# EAGLE design MCU-schematic (EAGLE 9.6.2)
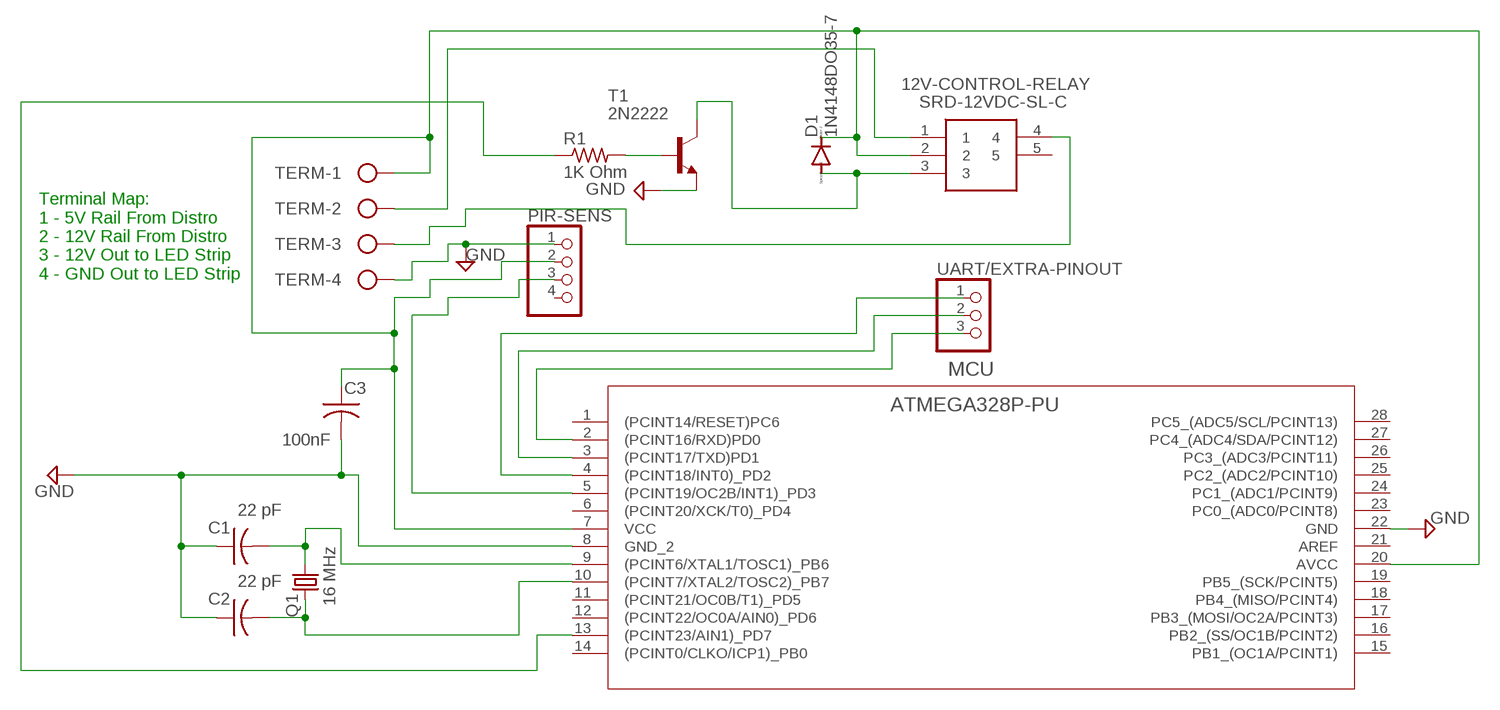
[diagram p0: schematic, sheet 1]

## Parts
12V-CONTROL-RELAY  SRD-12VDC-SL-C  [SRD]
C1  22 pF  C-USC0805  [C0805]
C2  22 pF  C-USC0805  [C0805]
C3  100nF  C-USC0805  [C0805]
D1  1N4148DO35-7  [DO35-7]
MCU  ATMEGA328P-PU  [28P3_ATM]
PIR-SENS  PINHD-1X4  [1X04]
Q1  16 MHz  CRYSTALHC49S  [HC49/S]
R1  1K Ohm  R-US_R0805  [R0805]
T1  2N2222  [TO18]
TERM  W237-4  [W237-4]
UART/EXTRA-PINOUT  PINHD-1X3  [1X03]

## Nets
GND: C1.1 C2.1 C3.2 MCU.8(GND_2) MCU.22(GND) PIR-SENS.1 T1.1(E) TERM.4
N$1: 12V-CONTROL-RELAY.4 TERM.3
N$2: C1.2 MCU.9((PCINT6/XTAL1/TOSC1)_PB6) Q1.2
N$3: C2.2 MCU.10((PCINT7/XTAL2/TOSC2)_PB7) Q1.1
N$4: MCU.13((PCINT23/AIN1)_PD7) R1.1
N$5: MCU.2((PCINT16/RXD)PD0) UART/EXTRA-PINOUT.3
N$6: 12V-CONTROL-RELAY.1 TERM.2
N$7: 12V-CONTROL-RELAY.2 C3.1 D1.C MCU.7(VCC) MCU.20(AVCC) PIR-SENS.2 TERM.1
N$8: MCU.5((PCINT19/OC2B/INT1)_PD3) PIR-SENS.3
N$9: MCU.3((PCINT17/TXD)PD1) UART/EXTRA-PINOUT.2
N$10: MCU.4((PCINT18/INT0)_PD2) UART/EXTRA-PINOUT.1
N$12: 12V-CONTROL-RELAY.3 D1.A T1.3(C)
N$13: R1.2 T1.2(B)
Unconnected: 12V-CONTROL-RELAY.5 MCU.1((PCINT14/RESET)PC6) MCU.6((PCINT20/XCK/T0)_PD4) MCU.11((PCINT21/OC0B/T1)_PD5) MCU.12((PCINT22/OC0A/AIN0)_PD6) MCU.14((PCINT0/CLKO/ICP1)_PB0) MCU.15(PB1_(OC1A/PCINT1)) MCU.16(PB2_(SS/OC1B/PCINT2)) MCU.17(PB3_(MOSI/OC2A/PCINT3)) MCU.18(PB4_(MISO/PCINT4)) MCU.19(PB5_(SCK/PCINT5)) MCU.21(AREF) MCU.23(PC0_(ADC0/PCINT8)) MCU.24(PC1_(ADC1/PCINT9)) MCU.25(PC2_(ADC2/PCINT10)) MCU.26(PC3_(ADC3/PCINT11)) MCU.27(PC4_(ADC4/SDA/PCINT12)) MCU.28(PC5_(ADC5/SCL/PCINT13)) PIR-SENS.4

## Notes on the sheet
- Terminal Map:
  1 - 5V Rail From Distro
  2 - 12V Rail From Distro
  3 - 12V Out to LED Strip
  4 - GND Out to LED Strip

## Library data of the parts
12V-CONTROL-RELAY = SRD-12VDC-SL-C:SRD-12VDC-SL-C: SRD Relay, ISO9002, 10A Switching Cap. Sealed Type, 0.36W, 1 Form C Source: Datasheet; DESCRIPTION: SRD Relay, ISO9002, 10A Switching Cap. Sealed Type, 0.36W, 1 Form C; HEIGHT: mm; MANUFACTURER_NAME: Songle Relay; MANUFACTURER_PART_NUMBER: SRD-12VDC-SL-C; OC_NEWARK: unknown
C1 C2 = rcl:C-US: CAPACITOR, American symbol; MF: SAMSUNG ELECTRO-MECHANICS; MPN: CL21C220JBANNNC; OC_NEWARK: 82AC9473; SPICEPREFIX: C
C3 = rcl:C-US: CAPACITOR, American symbol; MF: KEMET; MPN: C0805C104J5RACTU; OC_NEWARK: 64K2889; SPICEPREFIX: C
D1 = diode:1N4148: DIODE high speed (Philips); OC_NEWARK: unknown
MCU = ATMega328P-PU:ATMEGA328P-PU; COPYRIGHT: Copyright (C) 2021 Ultra Librarian. All rights reserved.; MANUFACTURER_PART_NUMBER: ATMEGA328P-PU; MF: MICROCHIP; MFR_NAME: Microchip; MPN: ATMEGA328P-PU; OC_NEWARK: 68T2944
PIR-SENS = pinhead:PINHD-1X4: PIN HEADER; OC_NEWARK: unknown
Q1 = crystal:CRYSTAL: CRYSTAL; OC_FARNELL: 1667008; OC_NEWARK: unknown
R1 = rcl:R-US_: RESISTOR, American symbol; MF: TDK; MPN: MPZ2012S102JTD25; OC_NEWARK: 81AH9111; SPICEPREFIX: R
T1 = transistor:2N2222: NPN TRANSISTOR; MF: MULTICOMP PRO; MPN: 2N2222; OC_NEWARK: 87K2254
TERM = con-wago-500:W237-4: WAGO SCREW CLAMP; OC_FARNELL: unknown; OC_NEWARK: unknown
UART/EXTRA-PINOUT = pinhead:PINHD-1X3: PIN HEADER; OC_NEWARK: unknown

## Board
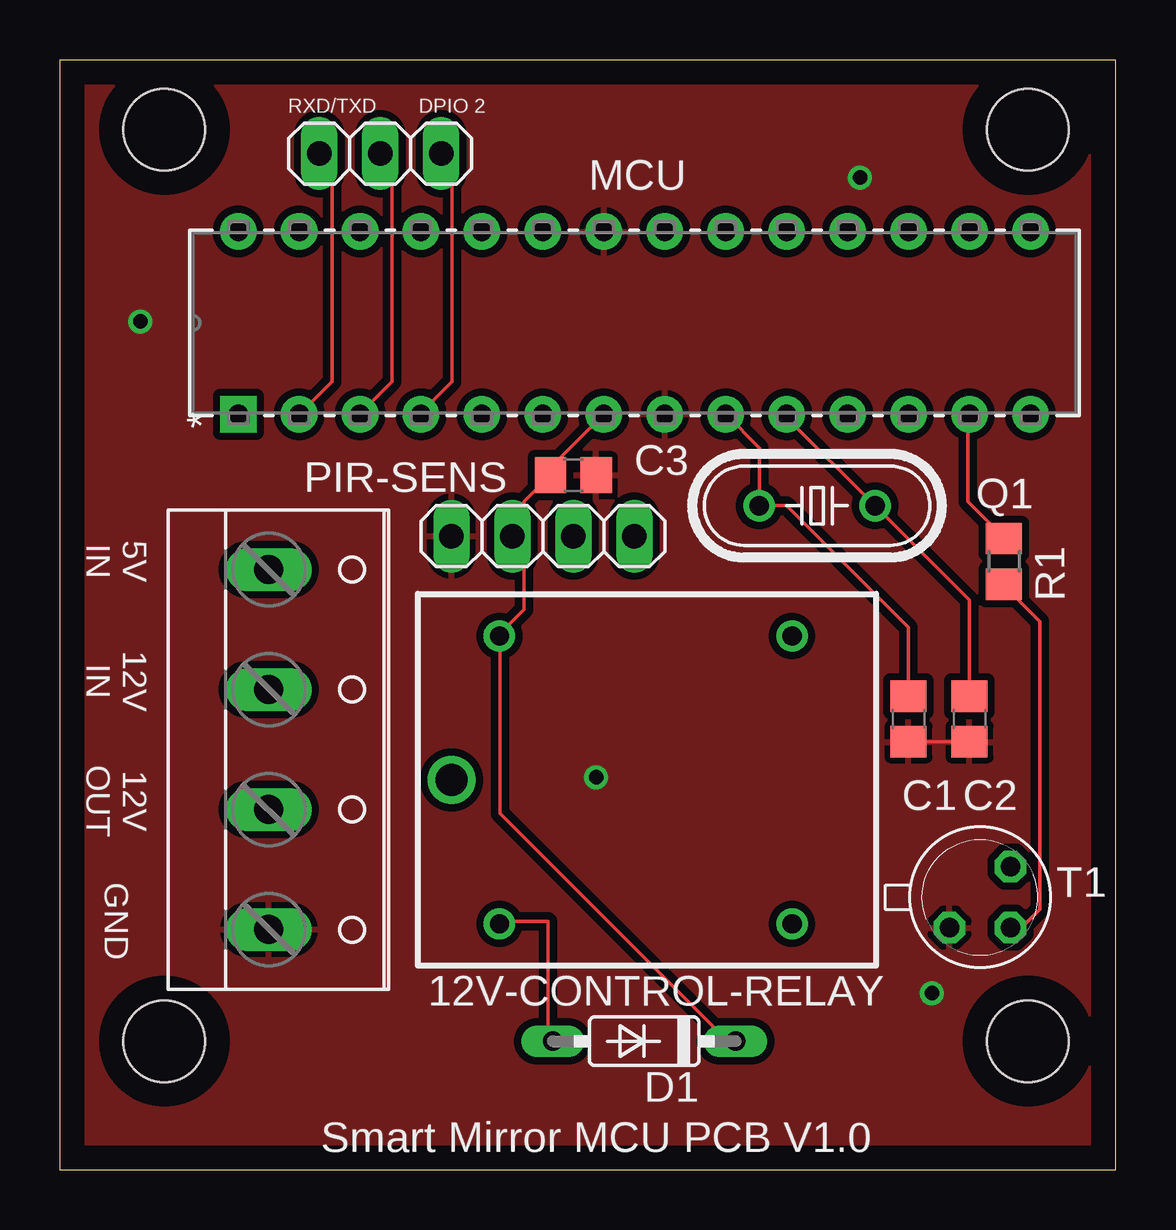
[diagram p1: board, top side]
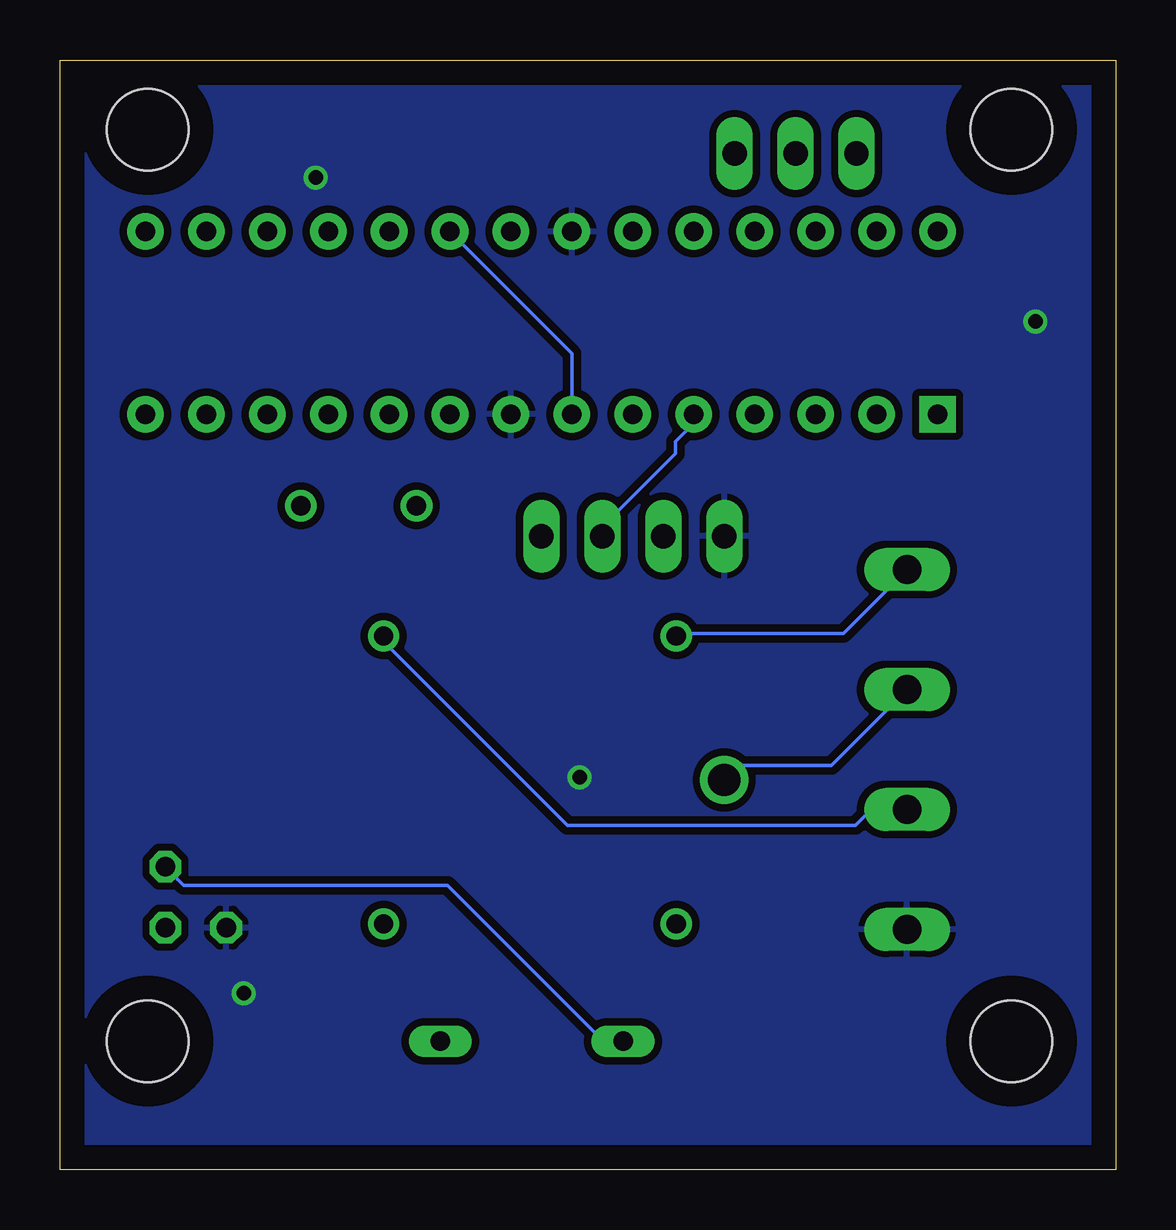
[diagram p2: board, bottom side, seen from below]

Size 44.01 x 46.25 mm. Coordinates in mm from the lower left corner, seen from the top.
Outline: 0,0 44.01,0 44.01,46.25 0,46.25 0,0
Copper layers (1*16): Top 0.035mm / dielectric 1.5mm / Bottom 0.035mm
Design rules "default": minimum track width 6mil, minimum drill 0.35mm, track to track 6mil, track to pad 6mil, pad to pad 6mil, via to via 6mil, smd to smd 6mil, copper to edge 40mil, drill to drill 6mil, minimum pad ring 10mil, minimum via ring 8mil, stop-mask expansion 4mil, vias tented up to drill 0mil, thermal gap 10mil
Holes 3.4 mm at 4.35,43.35 40.35,43.35 40.35,5.35 4.35,5.35

### Footprints (pad centres in the part's own frame; a part is rotated, then mirrored left to right if it is on the bottom)
SRD = drill 1.34 pad 1.84: 1 0,0 | drill 0.8 pad 1.3: 2 2,6; 3 2,-6; 4 14.2,6; 5 14.2,-6
C0805 = smd 1.3 x 1.5: 1 -0.95,0; 2 0.95,0
DO35-7 = drill 0.813 long: A 3.81,0; C -3.81,0
28P3_ATM = drill 0.813 pad 1.524 square: 1 0,0 | drill 0.813 pad 1.524: 2 0,-2.54; 3 0,-5.08; 4 0,-7.62; 5 0,-10.16; 6 0,-12.7; 7 0,-15.24; 8 0,-17.78; 9 0,-20.32; 10 0,-22.86; 11 0,-25.4; 12 0,-27.94; 13 0,-30.48; 14 0,-33.02; 15 7.62,-33.02; 16 7.62,-30.48; 17 7.62,-27.94; 18 7.62,-25.4; 19 7.62,-22.86; 20 7.62,-20.32; 21 7.62,-17.78; 22 7.62,-15.24; 23 7.62,-12.7; 24 7.62,-10.16; 25 7.62,-7.62; 26 7.62,-5.08; 27 7.62,-2.54; 28 7.62,0
1X04 = drill 1.016 long: 1 -3.81,0; 2 -1.27,0; 3 1.27,0; 4 3.81,0
HC49/S = drill 0.813: 1 -2.413,0; 2 2.413,0
R0805 = smd 1.3 x 1.5: 1 -0.95,0; 2 0.95,0
TO18 = drill 0.813 octagon: 1 -1.27,-1.27; 2 1.27,-1.27; 3 1.27,1.27
W237-4 = drill 1.194 long: 1 -7.5,-1.27; 2 -2.5,-1.27; 3 2.5,-1.27; 4 7.5,-1.27
1X03 = drill 1.016 long: 1 -2.54,0; 2 0,0; 3 2.54,0

### Placement (x,y rotation side)
12V-CONTROL-RELAY  16.32,16.24 0 top
C1  35.37,18.78 90 top
C2  37.91,18.78 90 top
C3  21.4,28.94 0 top
D1  24.35,5.35 180 top
MCU  7.43,31.48 90 top
PIR-SENS  20.13,26.4 0 top
Q1  31.56,27.67 180 top
R1  39.35,25.35 270 top
T1  38.35,11.35 0 top
TERM  9.97,17.51 270 top
UART/EXTRA-PINOUT  13.35,42.35 180 top

### Tracks (layer width: path | path; a pad name or v marks a point on that pad's centre or on a via)
GND  (via drill 0.6)
  Top 0.152: C2.1 C1.1
  other vias: 3.35,35.35 33.35,41.35 36.35,7.35 22.35,16.35
  pour Top (isolate 0.305): -2.65,48.35 45.35,48.35 45.35,-0.65 -2.65,-0.65
  pour Bottom (isolate 0.305): -3.65,49.35 46.35,49.35 46.35,-1.65 -3.65,-1.65
N$1
  Bottom 0.152: 12V-CONTROL-RELAY.4 30.35,21.85 22.85,14.35 10.85,14.35 9.85,15.35 8.85,15.35 TERM.3
N$2
  Top 0.152: MCU.9 29.15,30.08 Q1.2 30.29,27.67 35.37,22.59 C1.2
N$3
  Top 0.152: C2.2 37.91,23.73 Q1.1 30.29,31.35 MCU.10
N$4
  Top 0.152: R1.1 39.35,26.35 37.85,27.85 37.85,31.35 MCU.13
N$5
  Top 0.152: MCU.2 10.35,31.85 11.35,32.85 11.35,41.85 10.85,42.35 UART/EXTRA-PINOUT.3
N$6
  Bottom 0.152: TERM.2 8.85,19.85 11.85,16.85 15.85,16.85 16.35,16.35 12V-CONTROL-RELAY.1
N$7
  Top 0.152: MCU.7 20.45,29.26 C3.1 20.35,28.85 19.35,27.85 19.35,26.85 PIR-SENS.2 19.35,26.35 19.35,23.35 18.35,22.35 12V-CONTROL-RELAY.2 18.35,21.85 18.35,14.85 27.85,5.35 D1.C
  Bottom 0.152: MCU.7 22.67,34.02 MCU.20 | TERM.1 8.85,24.85 11.35,22.35 17.85,22.35 12V-CONTROL-RELAY.2
N$8
  Bottom 0.152: PIR-SENS.3 21.35,26.85 18.35,29.85 18.35,30.35 17.35,31.35 MCU.5
N$9
  Top 0.152: UART/EXTRA-PINOUT.2 13.85,41.85 13.85,32.85 12.85,31.85 MCU.3
N$10
  Top 0.152: MCU.4 15.35,31.85 16.35,32.85 16.35,42.35 UART/EXTRA-PINOUT.1
N$12
  Top 0.152: 12V-CONTROL-RELAY.3 18.35,10.35 20.35,10.35 20.35,5.35 D1.A
  Bottom 0.152: T1.3 38.85,11.85 27.85,11.85 21.35,5.35 D1.A
N$13
  Top 0.152: R1.2 39.35,24.35 40.85,22.85 40.85,10.85 39.85,9.85 T1.2

### Text on the board
tPlace: RXD/TXD | DPIO 2 | 5V / IN | 12V / IN | 12V / OUT | GND | Smart Mirror MCU PCB V1.0